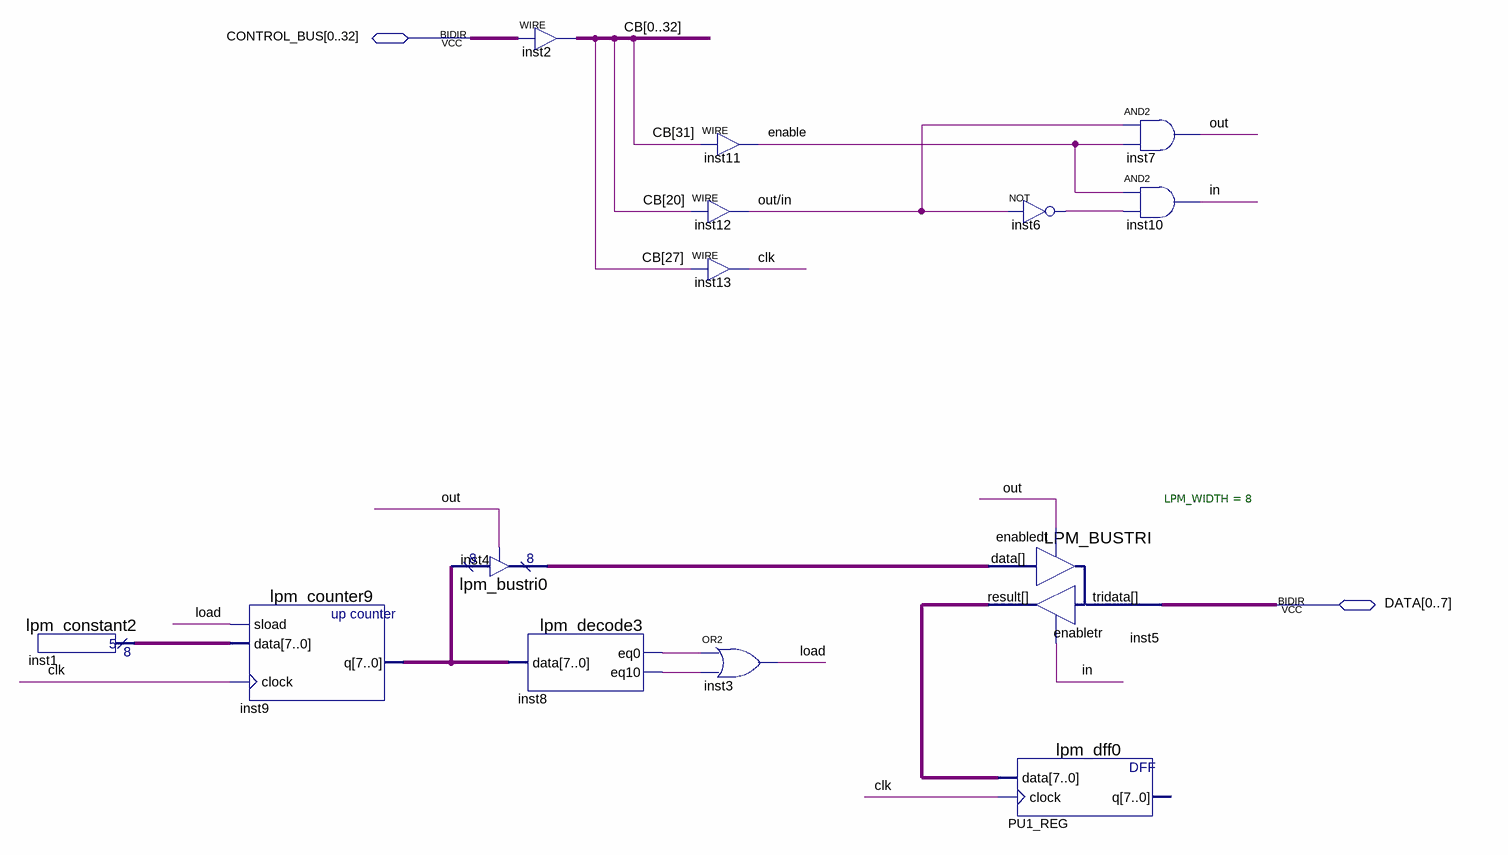
[diagram p0: schematic sheet]
// Quartus schematic PU1.bdf as structural Verilog: 14 symbols, 2 pins
module PU1 (
  inout  [0:32] CONTROL_BUS,
  inout  [0:7] DATA
);

  wire clk, enable, in, inst6_out, inst8_eq0, inst8_eq10, load, out, \out/in ;
  wire [7:0] inst1_result, inst4_tridata, inst5_result, inst9_q;
  wire [32:0] CB;

  lpm_constant2 inst1 (.result(inst1_result));
  lpm_counter9 inst9 (.sload(load), .data(inst1_result), .clock(clk), .q(inst9_q));
  lpm_bustri0 inst4 (.enabledt(out), .data(inst9_q), .tridata(inst4_tridata));
  assign {CB[0], CB[1], CB[2], CB[3], CB[4], CB[5], CB[6], CB[7], CB[8], CB[9], CB[10], CB[11], CB[12], CB[13], CB[14], CB[15], CB[16], CB[17], CB[18], CB[19], CB[20], CB[21], CB[22], CB[23], CB[24], CB[25], CB[26], CB[27], CB[28], CB[29], CB[30], CB[31], CB[32]} = CONTROL_BUS;  // WIRE inst2
  lpm_decode3 inst8 (.data(inst9_q), .eq0(inst8_eq0), .eq10(inst8_eq10));
  assign \out/in  = CB[20];  // WIRE inst12
  assign clk = CB[27];  // WIRE inst13
  assign enable = CB[31];  // WIRE inst11
  or inst3 (load, inst8_eq0, inst8_eq10);
  LPM_BUSTRI #(.LPM_WIDTH(8)) inst5 (
    .data(inst4_tridata), .enabledt(out), .enabletr(in), .result(inst5_result), .tridata(DATA));
  lpm_dff0 PU1_REG (.data(inst5_result), .clock(clk));  // open: q
  not inst6 (inst6_out, \out/in );
  and inst7 (out, \out/in , enable);
  and inst10 (in, enable, inst6_out);
endmodule
